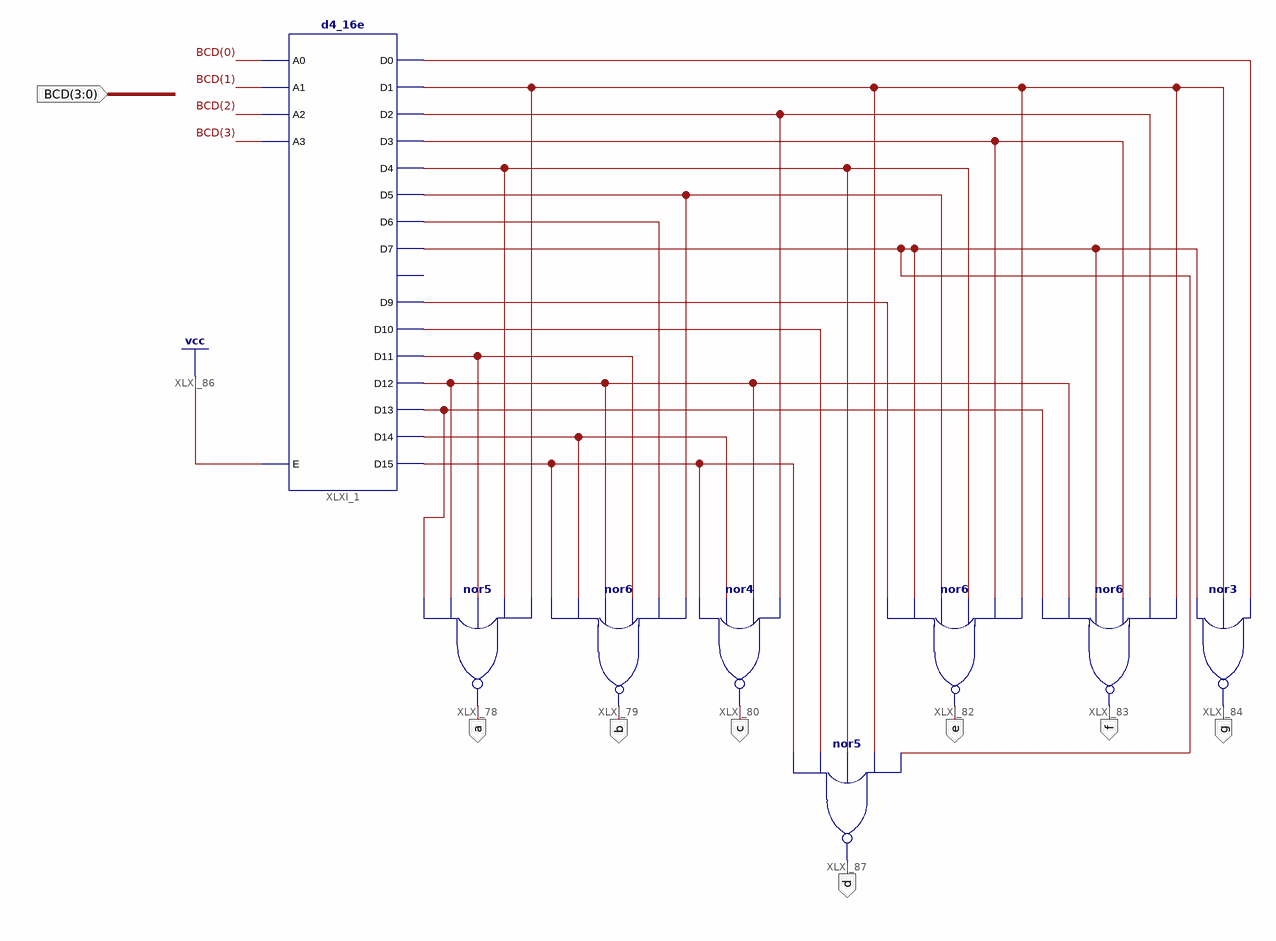
[diagram p0: schematic sheet 1]
// Xilinx ISE schematic BCDtoHex7segment.sch (spartan6) as structural Verilog: 8 symbols, 8 ports
module BCDtoHex7segment (
  input  [3:0] BCD,
  output a,
  output b,
  output c,
  output e,
  output f,
  output g,
  output d
);

  wire XLXN_143, XLXN_168, XLXN_170, XLXN_172, XLXN_174, XLXN_178, XLXN_180, XLXN_181, XLXN_184, XLXN_185,
       XLXN_187, XLXN_189, XLXN_193, XLXN_195, XLXN_201;

  d4_16e XLXI_1 (
    .A0(BCD[0]), .A1(BCD[1]), .A2(BCD[2]), .A3(BCD[3]), .E(1'b1), .D0(XLXN_143), .D1(XLXN_168),
    .D10(XLXN_185), .D11(XLXN_187), .D12(XLXN_189), .D13(XLXN_193), .D14(XLXN_195), .D15(XLXN_201),
    .D2(XLXN_170), .D3(XLXN_172), .D4(XLXN_174), .D5(XLXN_178), .D6(XLXN_180), .D7(XLXN_181), .D9(XLXN_184));  // open: D8
  nor XLXI_78 (a, XLXN_193, XLXN_189, XLXN_187, XLXN_174, XLXN_168);
  nor XLXI_79 (b, XLXN_201, XLXN_195, XLXN_189, XLXN_187, XLXN_180, XLXN_178);
  nor XLXI_80 (c, XLXN_201, XLXN_195, XLXN_189, XLXN_170);
  nor XLXI_82 (e, XLXN_184, XLXN_181, XLXN_178, XLXN_174, XLXN_172, XLXN_168);
  nor XLXI_83 (f, XLXN_193, XLXN_189, XLXN_181, XLXN_172, XLXN_170, XLXN_168);
  nor XLXI_84 (g, XLXN_181, XLXN_168, XLXN_143);
  nor XLXI_87 (d, XLXN_201, XLXN_185, XLXN_174, XLXN_168, XLXN_181);
endmodule
